# EAGLE design Power 12V-0.5A (EAGLE 9.4.2)
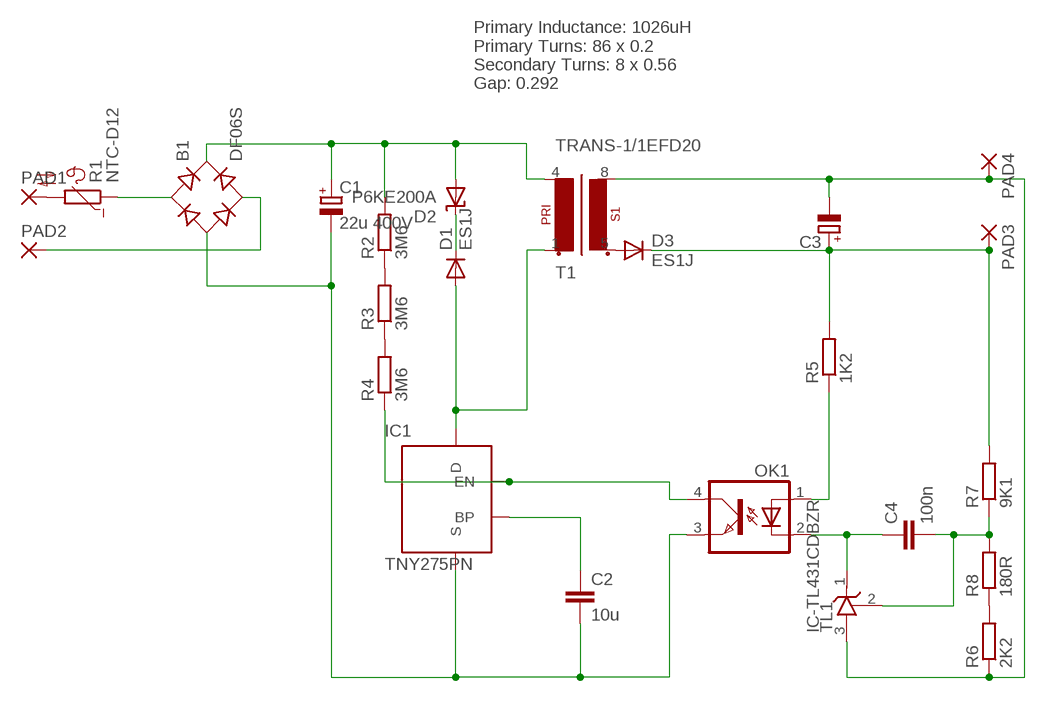
[diagram p0: schematic, sheet 1]

## Parts
B1  DF06S  [DFS]
C1  22u 400V  CPOL-EUE5-13  [E5-13]
C2  10u  CAP_1210  [C1210]
C3  CPOL-EUE7.5-18  [E7,5-18]
C4  100n  CAP_0805  [C0805]
D1  ES1J  DIODE_ES1J  [DO214AC]
D2  P6KE200A  SUPRESSORDO-204AC  [DO15-12]
D3  ES1J  DIODE_ES1J  [DO214AC]
IC1  TNY275PN  POWER-TNY275  [DIP-8C]
OK1  OPTOTRANSPC817  [DIL04]
PAD1  SMD5  [SMD2,54-5,08]
PAD2  SMD5  [SMD2,54-5,08]
PAD3  SMD5  [SMD2,54-5,08]
PAD4  SMD5  [SMD2,54-5,08]
R1  NTC-D12  [NTC-D12]
R2  3M6  R_0805  [R0805]
R3  3M6  R_0805  [R0805]
R4  3M6  R_0805  [R0805]
R5  1K2  R_1206  [R1206]
R6  2K2  R_R0805  [RESC2012X50]
R7  9K1  R_1206  [R1206]
R8  180R  R_1206  [R1206]
T1  TRANS-1/1EFD20  [EFD20_8PIN]
TL1  IC-TL431CDBZR  [SOT23]

## Nets
N$1: PAD1.1(P) R1.2
N$2: B1.AC1 R1.1
N$3: B1.AC2 PAD2.1(P)
N$4: B1.+ C1.+ D2.A R2.2 T1.4(P1-2)
N$5: B1.- C1.- C2.2 IC1.5(S) IC1.6(S) IC1.7(S) IC1.8(S) OK1.3(EMIT)
N$6: R6.2 R8.1
N$7: C2.1 IC1.2(BP)
N$8: D1.A IC1.4(D) T1.1(P1-1)
N$10: D1.C D2.C
N$11: IC1.1(EN) OK1.4(COL) R4.1
N$13: R2.1 R3.2
N$14: R3.1 R4.2
N$16: D3.A T1.5(S1-1)
N$17: C3.+ D3.C PAD3.1(P) R5.2 R7.2
N$18: C3.- PAD4.1(P) R6.1 T1.8(S1-2) TL1.3(A)
N$19: OK1.1(A) R5.1
N$20: C4.1 OK1.2(C) TL1.1(C)
N$21: C4.2 R7.1 R8.2 TL1.2(R)

## Notes on the sheet
- Primary Inductance: 1026uH
  Primary Turns: 86 x 0.2
  Secondary Turns: 8 x 0.56
  Gap: 0.292

## Library data of the parts
B1 = rectifier:DF*S: Surface Mount Glass Passivated Bridge Rectifiers Source: Source: Comchip Bridge Rectifiers DF005S-G thru DF10S-G.pdf
C1 C3 = rcl:CPOL-EU: POLARIZED CAPACITOR, European symbol; SPICEPREFIX: C
C2 C4 = Namenlos:CAP_
D1 D3 = Namenlos:DIODE_
D2 = Namenlos:SUPRESSOR
IC1 = Flamberm:POWER-TNY275
OK1 = Namenlos:OPTOTRANS: SHARP OPTO COUPLER; MPN: PC817X4J000F; OC_FARNELL: 9707727; OC_NEWARK: 97K7059
PAD1-PAD4 = wirepad:SMD5: SMD PAD
R1 = Namenlos:NTC-D12
R2-R5 R7 R8 = Namenlos:R_
R6 = Flamberm:R_
T1 = Namenlos:TRANS-1/1
TL1 = Namenlos:IC-TL431

## Board
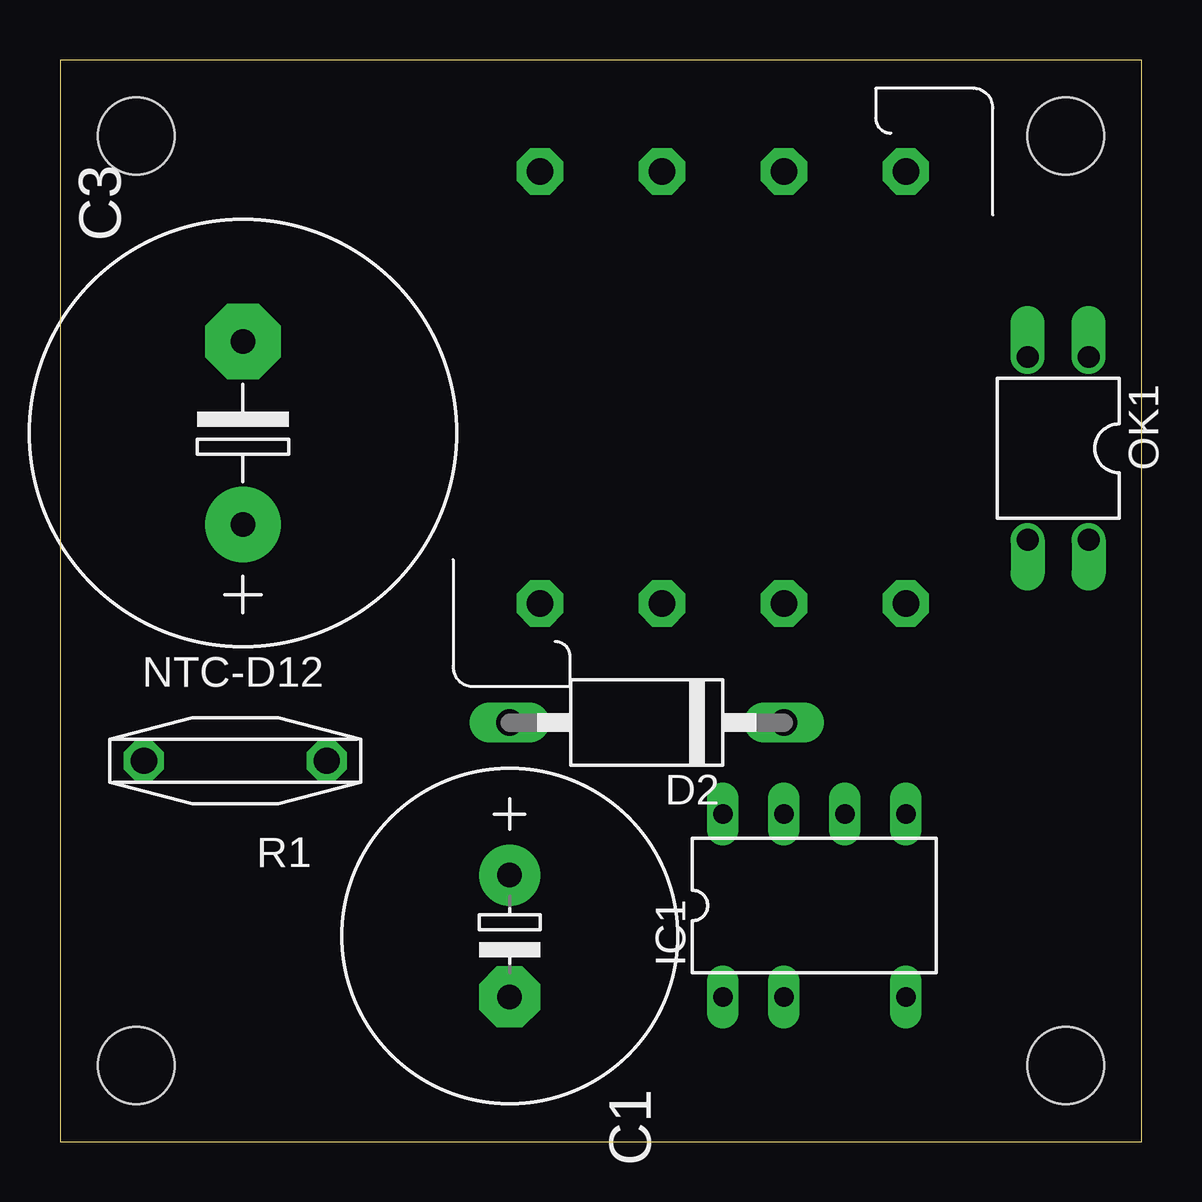
[diagram p1: board, top side]
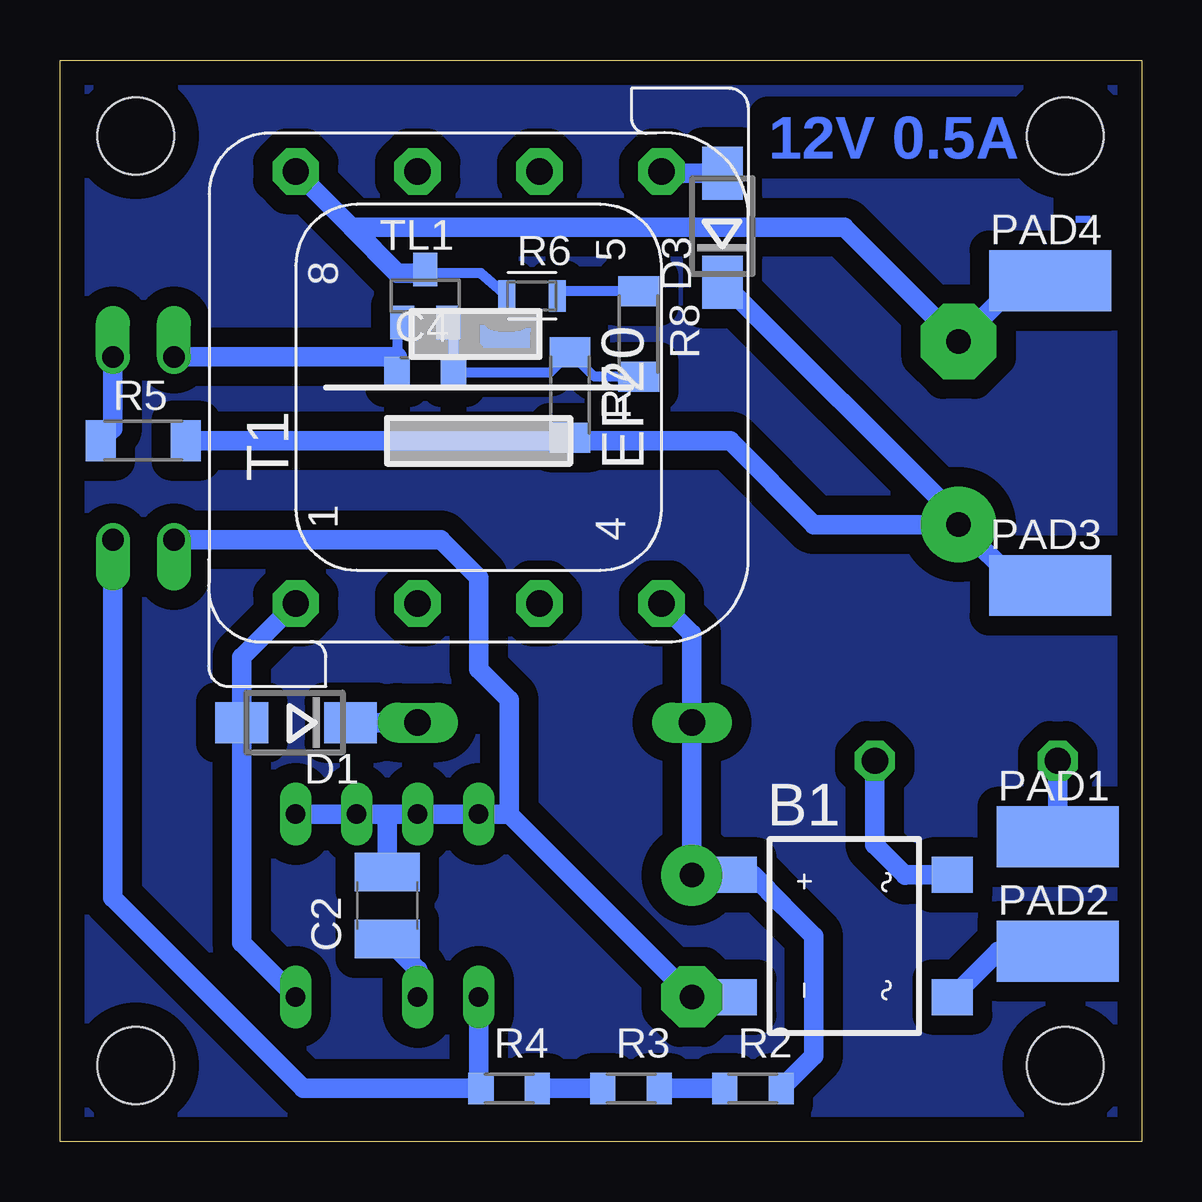
[diagram p2: board, bottom side, seen from below]

Size 45.06 x 45.07 mm. Coordinates in mm from the lower left corner, seen from the top.
Outline: 0,0 45.06,0 45.06,45.07 0,45.07 0,0
Copper layers (1*16): Top 0.035mm / dielectric 1.5mm / Bottom 0.035mm
Design rules "default": minimum track width 6mil, minimum drill 0.35mm, track to track 6mil, track to pad 6mil, pad to pad 6mil, via to via 6mil, smd to smd 6mil, copper to edge 40mil, drill to drill 6mil, minimum pad ring 10mil, minimum via ring 8mil, stop-mask expansion 4mil, vias tented up to drill 0mil, thermal gap 10mil
Holes 3.2 mm at 41.91,3.17 41.91,41.91 3.17,3.17 3.17,41.91

### Footprints (pad centres in the part's own frame; a part is rotated, then mirrored left to right if it is on the bottom)
DFS = smd 1.5 x 1.7: + -2.55,-4.5; - 2.55,-4.5; AC1 -2.55,4.5; AC2 2.55,4.5
E5-13 = drill 1.016 pad 2.54: + -2.54,0 | drill 1.016 pad 2.54 octagon: - 2.54,0
C1210 = smd 1.6 x 2.7: 1 -1.4,0; 2 1.4,0
E7,5-18 = drill 1.016 pad 3.15: + -3.81,0 | drill 1.016 pad 3.15 octagon: - 3.81,0
C0805 = smd 1.05 x 1.3: 1 -1.175,0; 2 1.175,0
DO214AC = smd 2.2 x 1.7: A 2.25,0; C -2.285,0
DO15-12 = drill 1.1 pad 1.676 long: A 5.08,0; C -6.35,0
DIP-8C = drill 0.813 long: 1 -3.81,-3.81; 2 -1.27,-3.81; 4 3.81,-3.81; 5 3.81,3.81; 6 1.27,3.81; 7 -1.27,3.81; 8 -3.81,3.81
DIL04 = drill 0.9 pad 1.27 offset: 1 -1.27,-3.81; 2 1.27,-3.81; 3 1.27,3.81; 4 -1.27,3.81
SMD2,54-5,08 = smd 2.54 x 5.08: 1 0,0
NTC-D12 = drill 1.1 pad 1.676 octagon: 1 -3.81,0; 2 3.81,0
R0805 = smd 1.05 x 1.3: 1 -1.175,0; 2 1.175,0
R1206 = smd 1.25 x 1.7: 1 -1.775,0; 2 1.775,0
RESC2012X50 = smd 0.712 x 1.312: 1 -1.05,0; 2 1.05,0
EFD20_8PIN = drill 1.1 pad 1.93 octagon: 1 -9,7.62; 2 -9,2.54; 3 -9,-2.54; 4 -9,-7.62; 5 9,-7.62; 6 9,-2.54; 7 9,2.54; 8 9,7.62
SOT23 = smd 1 x 1.4: 1 -0.95,-1.1; 2 0.95,-1.1; 3 0,1.1

### Placement (x,y rotation side)
B1  12.38,8.57 270 bottom
C1  18.73,8.57 270 top
C2  31.43,9.84 90 bottom
C3  7.62,29.53 90 top
C4  29.84,32.07 0 bottom
D1  35.24,17.46 180 bottom
D2  23.81,17.46 180 top
D3  17.46,38.1 90 bottom
IC1  31.43,9.84 0 top
OK1  41.59,28.89 180 top
PAD1  3.49,12.7 270 bottom
PAD2  3.49,7.94 270 bottom
PAD3  3.81,23.18 270 bottom
PAD4  3.81,35.88 270 bottom
R1  7.3,15.88 180 top
R2  16.19,2.22 0 bottom
R3  21.27,2.22 0 bottom
R4  26.35,2.22 0 bottom
R5  41.59,29.21 0 bottom
R6  25.4,35.24 0 bottom
R7  23.81,31.11 270 bottom
R8  20.95,33.66 270 bottom
T1  27.62,31.43 90 bottom
TL1  29.84,35.24 0 bottom

### Tracks (layer width: path | path; a pad name or v marks a point on that pad's centre or on a via)
N$1
  Bottom 0.813: PAD1.1 R1.2
N$2
  Bottom 0.813: B1.AC1 9.83,11.12 9.84,11.11 11.11,12.38 R1.1
N$3
  Bottom 0.813: PAD2.1 5.97,7.94 B1.AC2
N$4
  Bottom 0.813: R2.2 13.65,3.59 13.65,8.57 14.92,9.84 16.2,11.12 B1.+ 18.72,11.12 C1.+ D2.A 18.73,21.16 T1.4
N$5
  Bottom 0.813: B1.- C1.- 26.35,13.65 | 26.35,13.65 IC1.8 IC1.7 31.43,13.65 | 31.43,13.65 IC1.6 IC1.5 | C2.2 31.43,13.65 | OK1.3 29.21,25.08 27.62,23.5 27.62,19.68 26.35,18.41 26.35,13.65
N$6
  Bottom 0.406: 21.14,35.24 R8.1 24.04,35.43 R6.2
N$7
  Bottom 0.813: IC1.2 30.16,7.17 C2.1
N$8
  Bottom 0.813: T1.1 37.49,20.18 D1.A 37.49,8.28 IC1.4
N$9
  pour Bottom (isolate 0.813): 0,0 45.09,0 45.09,44.77 0,44.77
N$10
  Bottom 0.813: D2.C D1.C
N$11
  Bottom 0.813: IC1.1 27.62,2.32 | 27.62,2.32 R4.1 | OK1.4 42.86,10.16 34.92,2.22 27.72,2.22 27.62,2.32
N$13
  Bottom 0.813: R2.1 R3.2
N$14
  Bottom 0.813: R3.1 R4.2
N$16
  Bottom 0.813: D3.A 19.92,40.35 T1.5
N$17
  Bottom 0.813: R5.2 23.81,29.21 | 23.81,29.21 17.14,29.21 13.65,25.72 C3.+ | R7.2 23.81,29.21 | PAD3.1 5.08,23.18 C3.+ | D3.C 7.62,25.97 C3.+
N$18
  Bottom 0.406: R6.1 27.53,36.2 29.99,36.2
  Bottom 0.813: T1.8 32.91,38.1 | 32.91,38.1 31,36.2 29.99,36.2 TL1.3 | 32.91,38.1 12.38,38.1 C3.- 5.08,35.88 PAD4.1
N$19
  Bottom 0.813: R5.1 42.86,29.71 OK1.1
N$20
  Bottom 0.406: TL1.1 31.02,33.92 31.02,32.7 C4.1
  Bottom 0.813: OK1.2 31.02,32.7
N$21
  Bottom 0.406: TL1.2 28.67,33.92 C4.2 24.64,32.07 R7.1 22.8,31.88 R8.2

### Text on the board
Bottom: 12V 0.5A | -